# EAGLE schematic Binary Counter 4060 (EAGLE 9.6.2)
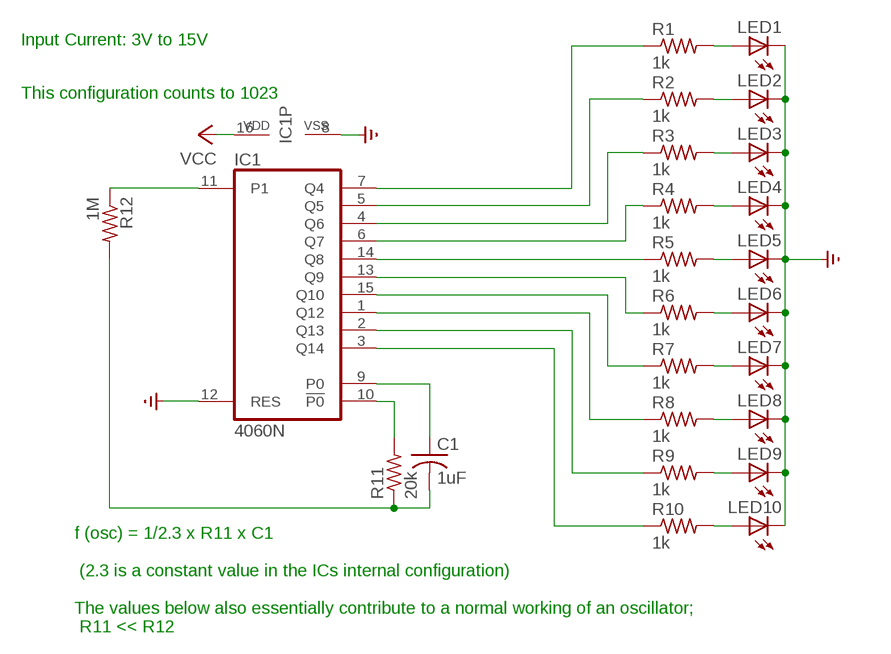
[diagram p0: schematic, sheet 1]

## Parts
C1  1uF  C-US050-030X075  [C050-030X075]
IC1  4060N  [DIL16]
LED1  LED3MM  [LED3MM]
LED2  LED3MM  [LED3MM]
LED3  LED3MM  [LED3MM]
LED4  LED3MM  [LED3MM]
LED5  LED3MM  [LED3MM]
LED6  LED3MM  [LED3MM]
LED7  LED3MM  [LED3MM]
LED8  LED3MM  [LED3MM]
LED9  LED3MM  [LED3MM]
LED10  LED3MM  [LED3MM]
R1  1k  R-US_0204/7  [0204/7]
R2  1k  R-US_0204/7  [0204/7]
R3  1k  R-US_0204/7  [0204/7]
R4  1k  R-US_0204/7  [0204/7]
R5  1k  R-US_0204/7  [0204/7]
R6  1k  R-US_0204/7  [0204/7]
R7  1k  R-US_0204/7  [0204/7]
R8  1k  R-US_0204/7  [0204/7]
R9  1k  R-US_0204/7  [0204/7]
R10  1k  R-US_0204/7  [0204/7]
R11  20k  R-US_0204/7  [0204/7]
R12  1M  R-US_0204/7  [0204/7]

## Nets
GND: IC1.8(VSS) IC1.12(RES) LED1.K(C) LED2.K(C) LED3.K(C) LED4.K(C) LED5.K(C) LED6.K(C) LED7.K(C) LED8.K(C) LED9.K(C) LED10.K(C) ; supply symbol labelled SUPPLY0_GND_
N$1: IC1.7(Q4) R1.1
N$2: IC1.5(Q5) R2.1
N$3: IC1.4(Q6) R3.1
N$4: IC1.6(Q7) R4.1
N$5: IC1.14(Q8) R5.1
N$6: IC1.13(Q9) R6.1
N$7: IC1.15(Q10) R7.1
N$8: IC1.1(Q12) R8.1
N$9: IC1.2(Q13) R9.1
N$10: IC1.3(Q14) R10.1
N$11: LED1.A R1.2
N$12: LED2.A R2.2
N$13: LED3.A R3.2
N$14: LED4.A R4.2
N$15: LED10.A R10.2
N$16: LED9.A R9.2
N$17: LED8.A R8.2
N$18: LED7.A R7.2
N$19: LED6.A R6.2
N$20: LED5.A R5.2
N$21: C1.1 IC1.9(P0)
N$22: IC1.10(!P0) R11.2
N$23: IC1.11(P1) R12.1
N$24: C1.2 R11.1 R12.2
VCC: IC1.16(VDD)

## Notes on the sheet
- Input Current: 3V to 15V
- This configuration counts to 1023
- f (osc) = 1/2.3 x R11 x C1
  
   (2.3 is a constant value in the ICs internal configuration)
  
  The values below also essentially contribute to a normal working of an oscillator;
   R11 << R12

## Library data of the parts
C1 = adafruit:C-US: CAPACITOR, American symbol
IC1 = 40xx:4060: 14-stage binary/ripple COUNTER
LED1-LED10 = adafruit:LED: LED OSRAM: - CHIPLED LG R971, LG N971, LY N971, LG Q971, LY Q971, LO R971, LY R971 LH N974, LH R974 LS Q976, LO Q976, LY Q976 LO Q996 - Hyper CHIPLED LW Q18S LB Q993, LB Q99A, LB R99A - SideLED LS A670, LO A670, LY A670, LG A670, LP A670 LB A673, LV A673, LT A673, LW A673 LH A674 LY A675 LS A676, LA A676, LO A676, LY A676, LW A676 LS A679, LY A679, LG A679 - Hyper Micro SIDELED® LS Y876, LA Y876, LO Y876, LY Y876 LT Y87S - SmartLED LW L88C, LW L88S LB L89C, LB L89S, LG L890 LS L89K, LO L89K, LY L89K LS L896, LA L896, LO L896, LY L896 - TOPLED LS T670, LO T670, LY T670, LG T670, LP T670 LSG T670, LSP T670, LSY T670, LOP T670, LYG T670 LG T671, LOG T671, LSG T671 LB T673, LV T673, LT T673, LW T673 LH T674 LS T676, LA T676, LO T676, LY T676, LB T676, LH T676, LSB T676, LW T676 LB T67C, LV T67C, LT T67C, LS T67K, LO T67K, LY T67K, LW E67C LS E67B, LA E67B, LO E67B, LY E67B, LB E67C, LV E67C, LT E67C LW T67C LS T679, LY T679, LG T679 LS T770, LO T770, LY T770, LG T770, LP T770 LB T773, LV T773, LT T773, LW T773 LH T774 LS E675, LA E675, LY E675, LS T675 LS T776, LA T776, LO T776, LY T776, LB T776 LHGB T686 LT T68C, LB T68C - Hyper Mini TOPLED® LB M676 - Mini TOPLED Santana® LG M470 LS M47K, LO M47K, LY M47K Source: http://www.osram.convergy.de/
R1-R12 = adafruit:R-US_: RESISTOR, American symbol